# EAGLE design Retrokit_SAMD_RevA (EAGLE 7.2.0)
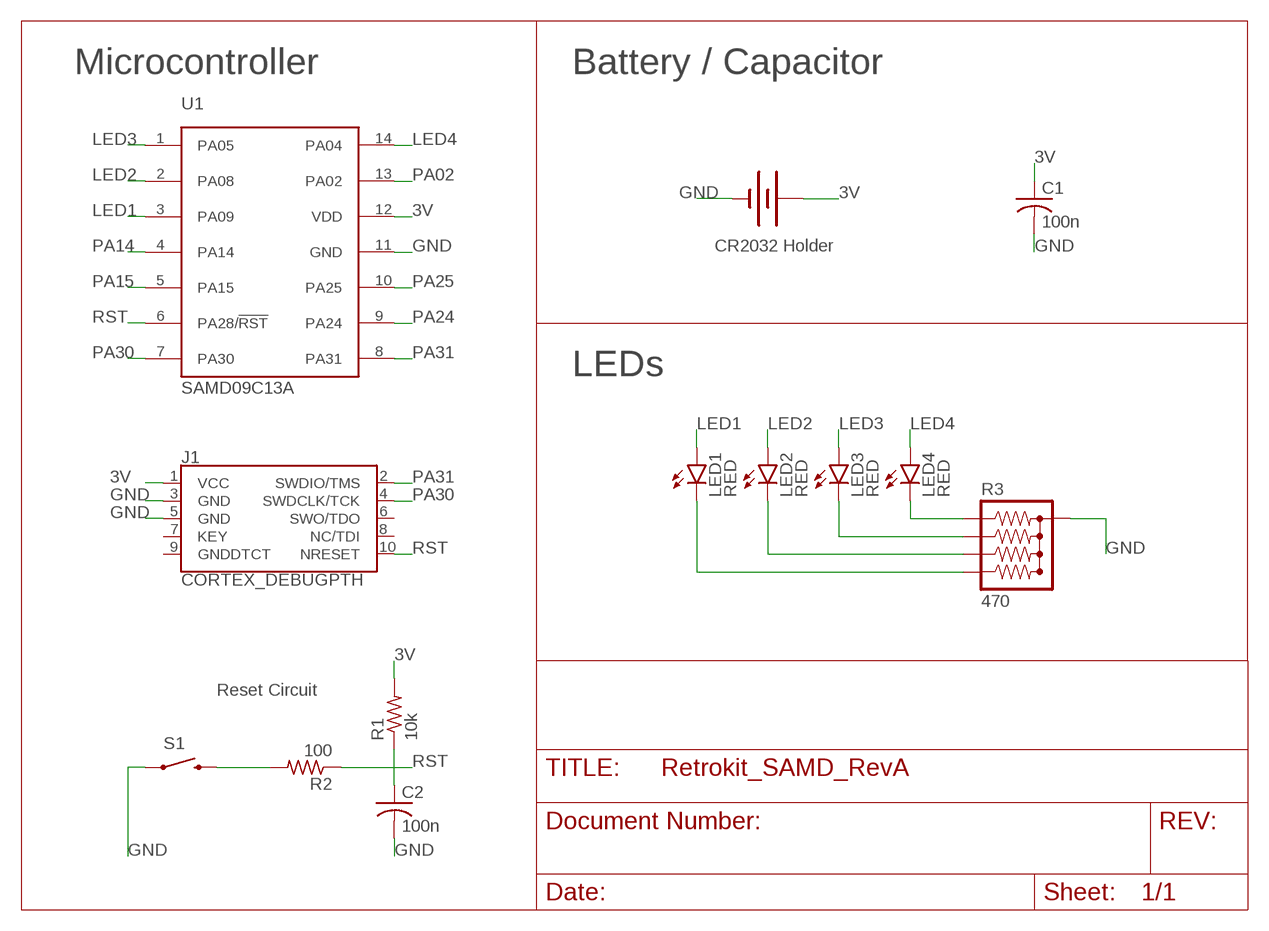
[diagram p0: schematic, sheet 1]

## Parts
BAT1  BATTERYFOB  [BATTERY_20MM_PTH_COMPACT]
C1  100n  C-US025-024X044  [C025-024X044]
C2  100n  C-USC0805  [C0805]
J1  CORTEX_DEBUGPTH  [2X5-PTH-1.27MM]
LED1  RED  LED3MM  [LED3MM]
LED2  RED  LED3MM  [LED3MM]
LED3  RED  LED3MM  [LED3MM]
LED4  RED  LED3MM  [LED3MM]
R1  10k  R-US_R0805  [R0805]
R2  100  R-US_R0805  [R0805]
R3  470  RBUSSED-5SIP  [RBUSSED-5SIP]
S1  SWITCH-MOMENTARY-2PTH  [TACTILE-PTH]
U1  SAMD09C13A  [SO14-NARROWPADS]

## Nets
3V: BAT1.1(+) C1.1 J1.1(VCC) R1.2 U1.12(VDD)
GND: BAT1.2(-) C1.2 C2.2 J1.3(GND) J1.5(GND) R3.GND S1.1 U1.11(GND)
LED1: LED1.A U1.3(PA09)
LED2: LED2.A U1.2(PA08)
LED3: LED3.A U1.1(PA05)
LED4: LED4.A U1.14(PA04)
N$1: R2.2 S1.3
N$2: LED1.K(C) R3.R4
N$3: LED2.K(C) R3.R3
N$4: LED3.K(C) R3.R2
N$5: LED4.K(C) R3.R1
PA02: U1.13(PA02)
PA14: U1.4(PA14)
PA15: U1.5(PA15)
PA24: U1.9(PA24)
PA25: U1.10(PA25)
PA30: J1.4(SWDCLK/TCK) U1.7(PA30)
PA31: J1.2(SWDIO/TMS) U1.8(PA31)
RST: C2.1 J1.10(NRESET) R1.1 R2.1 U1.6(PA28/!RST)
Unconnected: J1.6(SWO/TDO) J1.7(KEY) J1.8(NC/TDI) J1.9(GNDDTCT)

## Notes on the sheet
- Microcontroller | Battery / Capacitor
- CR2032 Holder
- LEDs
- Reset Circuit

## Library data of the parts
BAT1 = SparkFun-Electromechanical:BATTERY: Battery Holders Various common sizes : AA, AAA, 18650 (PRT-12895), 20mm coin cell and 12mm coin cell. 20MM_4LEGS, BATT-10373
C1 C2 = adafruit:C-US: CAPACITOR, American symbol
J1 = SparkFun-ConnectorsNEW:CORTEX_DEBUG: Cortex Debug Connector Datasheet <http://infocenter.arm.com/help/topic/com.arm.doc.faqs/attached/13634/cortex_debug_connectors.pdf>
LED1-LED4 = _CustomParts:LED: LEDs Standard schematic elements and footprints for 5mm, 3mm, 1206, and 0603 sized LEDs. 5mm - Spark Fun Electronics SKU : COM-00529 (and others)
R1 R2 = adafruit:R-US_: RESISTOR, American symbol
R3 = SyncChannelCustom:RBUSSED-5SIP: 5SIP Bussed Resistor Array Digikey: 4605X-101-331LF-ND (330 ohm)
S1 = SparkFun-Electromechanical:SWITCH-MOMENTARY-2: Various NO switches- pushbuttons, reed, etc
U1 = SyncChannelCustom:SAMD09C13A

## Board
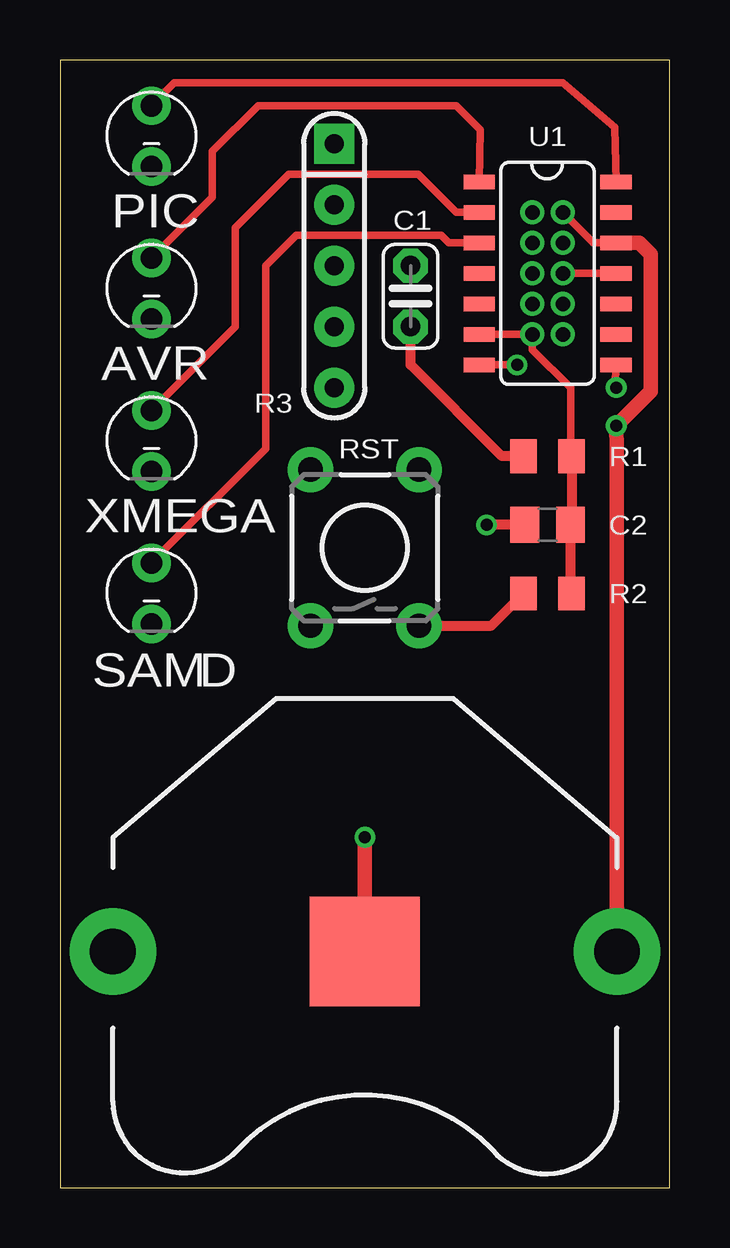
[diagram p1: board, top side]
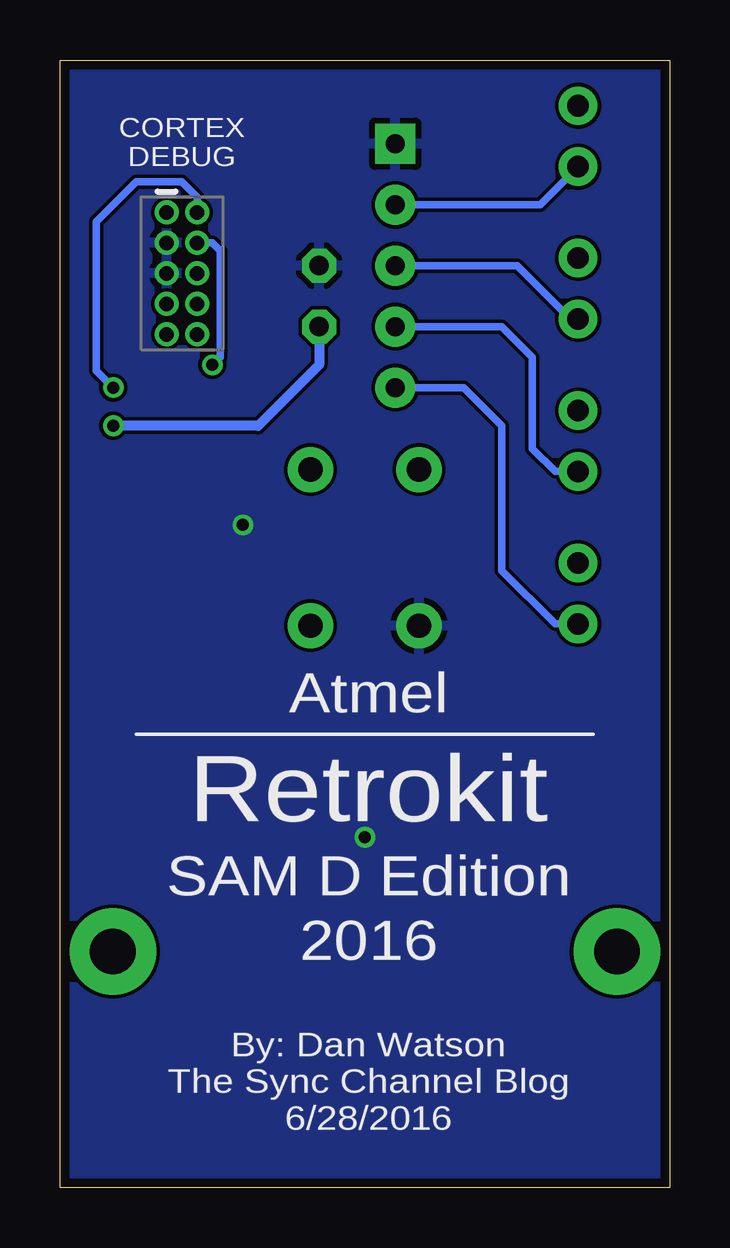
[diagram p2: board, bottom side, seen from below]

Size 25.4 x 46.99 mm. Coordinates in mm from the lower left corner, seen from the top.
Outline: 0,0 25.4,0 25.4,46.99 0,46.99 0,0
Copper layers (1*16): Top 0.0356mm / dielectric 1.5011mm / Bottom 0.0356mm
Design rules "oshpark-2layer *": minimum track width 6mil, minimum drill 13mil, track to track 6mil, track to pad 6mil, pad to pad 6mil, via to via 6mil, smd to smd 6mil, copper to edge 15mil, drill to drill 6mil, minimum pad ring 7mil, minimum via ring 7mil, stop-mask expansion 4mil, vias tented up to drill 20mil, thermal gap 10mil

### Footprints (pad centres in the part's own frame; a part is rotated, then mirrored left to right if it is on the bottom)
BATTERY_20MM_PTH_COMPACT = drill 1.9 pad 3.6: 1 -10.5,0; 3 10.5,0 | smd 4.572 x 4.572: 2 0,0
C025-024X044 = drill 0.813 pad 1.422 octagon: 1 -1.27,0; 2 1.27,0
C0805 = smd 1.2 x 1.5: 1 -0.95,0; 2 0.95,0
2X5-PTH-1.27MM = drill 0.6 pad 1: 1 -2.54,-0.635; 2 -2.54,0.635; 3 -1.27,-0.635; 4 -1.27,0.635; 5 0,-0.635; 6 0,0.635; 7 1.27,-0.635; 8 1.27,0.635; 9 2.54,-0.635; 10 2.54,0.635
LED3MM = drill 0.9 pad 1.6: A -1.27,0; K 1.27,0
R0805 = smd 1.1 x 1.4: 1 -1,0; 2 1,0
RBUSSED-5SIP = drill 0.8 pad 1.676 square: GND 0,0 | drill 0.8 pad 1.676: R1 0,-2.54; R2 0,-5.08; R3 0,-7.62; R4 0,-10.16
TACTILE-PTH = drill 1.016 pad 1.88: 1 -3.251,2.261; 2 3.251,2.261; 3 -3.251,-2.261; 4 3.251,-2.261
SO14-NARROWPADS = smd 0.6 x 1.3: 1 -3.81,-2.85; 2 -2.54,-2.85; 3 -1.27,-2.85; 4 0,-2.85; 5 1.27,-2.85; 6 2.54,-2.85; 7 3.81,-2.85; 8 3.81,2.85; 9 2.54,2.85; 10 1.27,2.85; 11 0,2.85; 12 -1.27,2.85; 13 -2.54,2.85; 14 -3.81,2.85

### Placement (x,y rotation side)
BAT1  12.7,9.84 180 top
C1  14.61,37.15 90 top
C2  20.32,27.62 180 top
J1  20.32,38.1 270 bottom
LED1  3.81,24.77 270 top
LED2  3.81,31.11 270 top
LED3  3.81,37.47 270 top
LED4  3.81,43.81 270 top
R1  20.32,30.48 180 top
R2  20.32,24.77 180 top
R3  11.43,43.5 0 top
S1  12.7,26.67 90 top
U1  20.32,38.1 270 top

### Tracks (layer width: path | path; a pad name or v marks a point on that pad's centre or on a via)
3V  (via drill 0.5)
  Top 0.305: U1.12 22.23,39.37 J1.1
  Top 0.406: R1.2 18.41,30.48 14.61,34.29 C1.1
  Top 0.61: U1.12 24.13,39.37 24.61,38.89 24.61,33.18 v23.18,31.75 23.2,30.77 BAT1.1
  Bottom 0.406: C1.1 14.61,34.29 17.14,31.75 v23.18,31.75
GND  (via drill 0.5)
  Top 0.305: U1.11 J1.5
  Top 0.406: C2.2 v17.78,27.62
  Top 0.61: v12.7,14.61 BAT1.2
  pour Bottom: -2.54,49.53 -2.54,-2.54 27.94,-2.54 27.94,49.53
LED1
  Top 0.305: U1.3 16.19,39.37 15.88,39.69 9.84,39.69 8.57,38.42 8.57,30.8 LED1.A
LED2
  Top 0.305: U1.2 16.51,40.64 14.92,42.23 9.53,42.23 7.3,40.01 7.3,35.88 LED2.A
LED3
  Top 0.305: U1.1 17.52,44.08 16.51,45.09 8.26,45.09 6.35,43.18 6.35,41.27 LED3.A
LED4
  Top 0.305: U1.14 23.12,44.19 20.95,46.04 4.76,46.04 LED4.A
N$1
  Top 0.406: S1.3 17.97,23.42 R2.2
N$2
  Bottom 0.305: LED1.K 4.76,23.5 6.99,25.72 6.99,31.75 8.57,33.34 R3.R4
N$3
  Bottom 0.305: LED2.K 4.76,29.84 5.71,30.8 5.71,34.61 6.99,35.88 R3.R3
N$4
  Bottom 0.305: LED3.K 4.13,36.2 6.35,38.42 R3.R2
N$5
  Bottom 0.305: R3.R1 5.4,40.96 LED4.K
PA30  (via drill 0.5)
  Top 0.305: U1.7 v19.05,34.29
  Bottom 0.305: J1.4 19.05,39.37 18.73,39.05 18.73,34.61 v19.05,34.29
PA31  (via drill 0.5)
  Top 0.305: U1.8 23.12,33.4 v23.18,33.34
  Bottom 0.305: J1.2 19.68,41.27 20.32,41.91 22.23,41.91 23.89,40.24 23.89,34.05 v23.18,33.34
RST
  Top 0.305: R1.1 21.27,30.53 21.27,33.34 19.68,34.92 J1.10 U1.6 | 21.32,27.99 C2.1 | 21.27,25.45 R2.1
  Top 0.406: R1.1 21.32,27.99 | C2.1 21.27,25.45

### Text on the board
tNames: U1 | PIC | C1 | AVR | R3 | RST | R1 | XMEGA | C2 | R2 | SAM | D
bNames: CORTEX / DEBUG | Atmel | Retrokit | SAM D Edition / 2016 | By: Dan Watson / The Sync Channel Blog / 6/28/2016